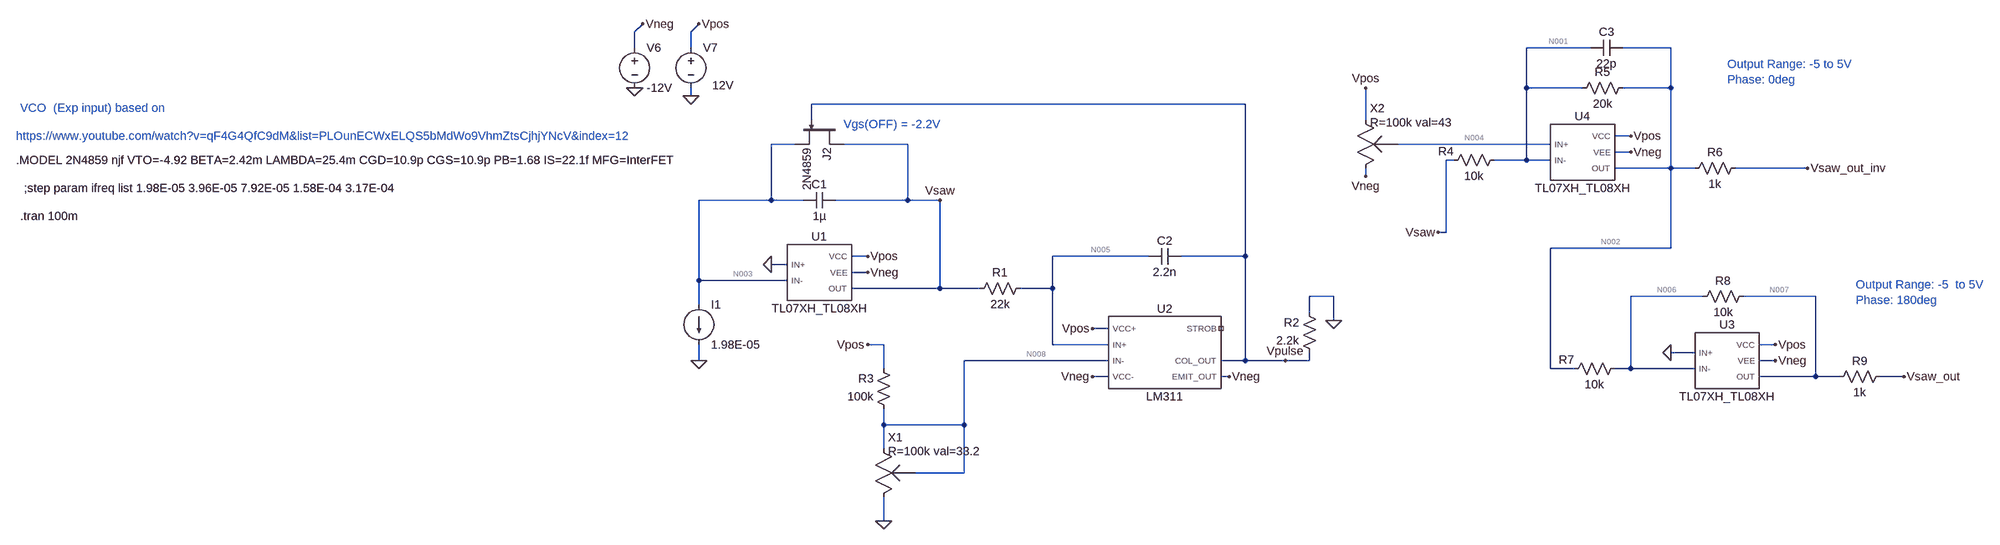
[diagram p0: schematic main_VCO_SAW.asc]
main_VCO_SAW.asc, the LTspice schematic file:
Version 4
SHEET 1 3072 1764
WIRE -1824 -624 -1808 -640
WIRE -1712 -624 -1696 -640
WIRE -1824 -592 -1824 -624
WIRE -1712 -592 -1712 -624
WIRE 80 -592 -48 -592
WIRE 240 -592 144 -592
WIRE -48 -512 -48 -592
WIRE 64 -512 -48 -512
WIRE 240 -512 240 -592
WIRE 240 -512 144 -512
WIRE -1712 -496 -1712 -512
WIRE -608 -480 -1472 -480
WIRE -1472 -448 -1472 -480
WIRE -368 -448 -368 -512
WIRE 160 -416 128 -416
WIRE -1504 -400 -1552 -400
WIRE -1280 -400 -1408 -400
WIRE 0 -400 -304 -400
WIRE 160 -384 128 -384
WIRE -192 -368 -208 -368
WIRE -48 -368 -48 -512
WIRE -48 -368 -112 -368
WIRE 0 -368 -48 -368
WIRE 240 -352 240 -512
WIRE 240 -352 128 -352
WIRE 288 -352 240 -352
WIRE 512 -352 368 -352
WIRE -368 -336 -368 -352
WIRE -1552 -288 -1552 -400
WIRE -1552 -288 -1696 -288
WIRE -1488 -288 -1552 -288
WIRE -1280 -288 -1280 -400
WIRE -1280 -288 -1424 -288
WIRE -1216 -288 -1280 -288
WIRE -208 -224 -208 -368
WIRE -208 -224 -224 -224
WIRE 240 -192 240 -352
WIRE 240 -192 0 -192
WIRE -1360 -176 -1392 -176
WIRE -800 -176 -992 -176
WIRE -608 -176 -608 -480
WIRE -608 -176 -736 -176
WIRE -1520 -160 -1552 -160
WIRE -1360 -144 -1392 -144
WIRE -1696 -128 -1696 -288
WIRE -1520 -128 -1696 -128
WIRE -1216 -112 -1216 -288
WIRE -1216 -112 -1392 -112
WIRE -1136 -112 -1216 -112
WIRE -992 -112 -992 -176
WIRE -992 -112 -1056 -112
WIRE -432 -96 -480 -96
WIRE 304 -96 160 -96
WIRE 528 -96 384 -96
WIRE -1696 -80 -1696 -128
WIRE -480 -64 -480 -96
WIRE -432 -48 -432 -96
WIRE -880 -32 -912 -32
WIRE -1328 0 -1360 0
WIRE -992 0 -992 -112
WIRE -880 0 -992 0
WIRE 448 0 416 0
WIRE 288 16 240 16
WIRE -1696 32 -1696 0
WIRE -880 32 -1168 32
WIRE -608 32 -608 -176
WIRE -608 32 -656 32
WIRE -528 32 -608 32
WIRE -480 32 -480 16
WIRE -480 32 -528 32
WIRE 448 32 416 32
WIRE -1328 48 -1328 0
WIRE 0 48 0 -192
WIRE 48 48 0 48
WIRE 160 48 160 -96
WIRE 160 48 128 48
WIRE 288 48 160 48
WIRE -880 64 -912 64
WIRE -640 64 -656 64
WIRE 528 64 528 -96
WIRE 528 64 416 64
WIRE 576 64 528 64
WIRE 704 64 656 64
WIRE -1328 160 -1328 128
WIRE -1168 160 -1168 32
WIRE -1168 160 -1328 160
WIRE -1328 208 -1328 160
WIRE -1168 256 -1168 160
WIRE -1168 256 -1264 256
WIRE -1328 352 -1328 304
FLAG -1824 -512 0
FLAG -1712 -496 0
FLAG -1808 -640 Vneg
FLAG -1696 -640 Vpos
FLAG -1696 32 0
FLAG -1552 -160 0
FLAG -1360 -144 Vneg
FLAG -1360 -176 Vpos
FLAG -912 -32 Vpos
FLAG -912 64 Vneg
FLAG -640 64 Vneg
FLAG -432 -48 0
FLAG -1216 -288 Vsaw
FLAG -528 32 Vpulse
FLAG -1328 352 0
FLAG 160 -384 Vneg
FLAG 160 -416 Vpos
FLAG 512 -352 Vsaw_out_inv
FLAG -224 -224 Vsaw
FLAG 448 32 Vneg
FLAG 448 0 Vpos
FLAG 704 64 Vsaw_out
FLAG 240 16 0
FLAG -368 -336 Vneg
FLAG -368 -512 Vpos
FLAG -1360 0 Vpos
SYMBOL voltage -1824 -608 R0
WINDOW 123 0 0 Left 0
WINDOW 39 0 0 Left 0
SYMATTR InstName V6
SYMATTR Value -12V
SYMBOL voltage -1712 -608 R0
WINDOW 123 0 0 Left 0
WINDOW 39 0 0 Left 0
WINDOW 3 43 91 Left 2
SYMATTR Value 12V
SYMATTR InstName V7
SYMBOL TL07XH_TL08XH -1456 -144 R0
SYMATTR InstName U1
SYMBOL current -1696 -80 R0
WINDOW 123 0 0 Left 0
WINDOW 39 0 0 Left 0
SYMATTR InstName I1
SYMATTR Value 1.98E-05
SYMBOL cap -1424 -304 R90
WINDOW 0 0 32 VBottom 2
WINDOW 3 32 32 VTop 2
SYMATTR InstName C1
SYMATTR Value 1µ
SYMBOL res -1040 -128 R90
WINDOW 0 0 56 VBottom 2
WINDOW 3 32 56 VTop 2
SYMATTR InstName R1
SYMATTR Value 22k
SYMBOL LM311 -768 16 R0
SYMATTR InstName U2
SYMBOL res -464 32 R180
WINDOW 0 36 76 Left 2
WINDOW 3 36 40 Left 2
SYMATTR InstName R2
SYMATTR Value 2.2k
SYMBOL cap -736 -192 R90
WINDOW 0 0 32 VBottom 2
WINDOW 3 32 32 VTop 2
SYMATTR InstName C2
SYMATTR Value 2.2n
SYMBOL res -1312 144 R180
WINDOW 0 36 76 Left 2
WINDOW 3 36 40 Left 2
SYMATTR InstName R3
SYMATTR Value 100k
SYMBOL pot -1344 192 R0
WINDOW 0 25 -7 Left 2
WINDOW 39 25 21 Left 2
SYMATTR InstName X1
SYMATTR SpiceLine R=100k val=33.2
SYMBOL njf -1408 -448 R90
SYMATTR InstName J2
SYMATTR Value 2N4859
SYMBOL TL07XH_TL08XH 64 -384 R0
SYMATTR InstName U4
SYMBOL res -96 -384 R90
WINDOW 0 14 112 VBottom 2
WINDOW 3 32 56 VTop 2
SYMATTR InstName R4
SYMATTR Value 10k
SYMBOL res 160 -528 R90
WINDOW 0 0 56 VBottom 2
WINDOW 3 32 56 VTop 2
SYMATTR InstName R5
SYMATTR Value 20k
SYMBOL cap 144 -608 R90
WINDOW 0 0 32 VBottom 2
WINDOW 3 32 32 VTop 2
SYMATTR InstName C3
SYMATTR Value 22p
SYMBOL res 384 -368 R90
WINDOW 0 0 56 VBottom 2
WINDOW 3 32 56 VTop 2
SYMATTR InstName R6
SYMATTR Value 1k
SYMBOL TL07XH_TL08XH 352 32 R0
SYMATTR InstName U3
SYMBOL res 144 32 R90
WINDOW 0 14 112 VBottom 2
WINDOW 3 32 56 VTop 2
SYMATTR InstName R7
SYMATTR Value 10k
SYMBOL res 400 -112 R90
WINDOW 0 0 56 VBottom 2
WINDOW 3 32 56 VTop 2
SYMATTR InstName R8
SYMATTR Value 10k
SYMBOL res 672 48 R90
WINDOW 0 0 56 VBottom 2
WINDOW 3 32 56 VTop 2
SYMATTR InstName R9
SYMATTR Value 1k
SYMBOL pot -384 -464 R0
WINDOW 0 25 -7 Left 2
WINDOW 39 25 21 Left 2
SYMATTR InstName X2
SYMATTR SpiceLine R=100k val=43
TEXT -3056 -416 Left 2 ;https://www.youtube.com/watch?v=qF4G4QfC9dM&list=PLOunECWxELQS5bMdWo9VhmZtsCjhjYNcV&index=12
TEXT -3048 -472 Left 2 ;VCO  (Exp input) based on
TEXT -3040 -312 Left 2 !;step param ifreq list 1.98E-05 3.96E-05 7.92E-05 1.58E-04 3.17E-04
TEXT -3048 -256 Left 2 !.tran 100m
TEXT -1408 -440 Left 2 ;Vgs(OFF) = -2.2V
TEXT -3056 -368 Left 2 !.MODEL 2N4859 njf VTO=-4.92 BETA=2.42m LAMBDA=25.4m CGD=10.9p CGS=10.9p PB=1.68 IS=22.1f MFG=InterFET
TEXT 352 -560 Left 2 ;Output Range: -5 to 5V\nPhase: 0deg
TEXT 608 -120 Left 2 ;Output Range: -5  to 5V\nPhase: 180deg

The netlist it stands for:
* main_VCO_SAW.asc
V6 Vneg 0 -12V
V7 Vpos 0 12V
XU1 0 N003 Vpos Vneg Vsaw TL07XH_TL08XH  ; pins IN+ IN- VCC VEE OUT
I1 N003 0 1.98E-05
C1 Vsaw N003 1µ
R1 N005 Vsaw 22k
XU2 N005 N008 Vpos Vneg NC_01 Vpulse Vneg LM311  ; pins IN+ IN- VCC+ VCC- STROB COL_OUT EMIT_OUT
R2 Vpulse 0 2.2k
C2 Vpulse N005 2.2n
R3 N008 Vpos 100k
XX1 N008 0 N008 pot R=100k val=33.2  ; pins 1 3 2
J2 Vsaw Vpulse N003 2N4859
XU4 N004 N001 Vpos Vneg N002 TL07XH_TL08XH  ; pins IN+ IN- VCC VEE OUT
R4 N001 Vsaw 10k
R5 N002 N001 20k
C3 N002 N001 22p
R6 Vsaw_out_inv N002 1k
XU3 0 N006 Vpos Vneg N007 TL07XH_TL08XH  ; pins IN+ IN- VCC VEE OUT
R7 N006 N002 10k
R8 N007 N006 10k
R9 Vsaw_out N007 1k
XX2 Vpos Vneg N004 pot R=100k val=43  ; pins 1 3 2
.model NJF NJF
.model PJF PJF
.lib standard.jft
* https://www.youtube.com/watch?v=qF4G4QfC9dM&list=PLOunECWxELQS5bMdWo9VhmZtsCjhjYNcV&index=12
* VCO  (Exp input) based on
;step param ifreq list 1.98E-05 3.96E-05 7.92E-05 1.58E-04 3.17E-04
.tran 100m
* Vgs(OFF) = -2.2V
.MODEL 2N4859 njf VTO=-4.92 BETA=2.42m LAMBDA=25.4m CGD=10.9p CGS=10.9p PB=1.68 IS=22.1f MFG=InterFET
* Output Range: -5 to 5V
* Phase: 0deg
* Output Range: -5  to 5V
* Phase: 180deg
.lib C:\HOME_projects\SYNTH_GOOM\2LineartoExponential\tl07xh_tl08xh.lib
.lib C:\HOME_projects\SYNTH_GOOM\2LineartoExponential\lm311.lib
.backanno
.end

* Results of the author's LTspice run, read from the files saved beside the schematic
* Operating Point, zero values left out:
*   V(vneg) = -12 V
*   V(vpos) = 12 V
*   V(vsaw) = -3.597 mV
*   V(n003) = -4.428 mV
*   V(n005) = -5.797 mV
*   V(vpulse) = -52.83 nV
*   V(n008) = 4.802 V
*   V(n002) = 5.034 V
*   V(n001) = 1.676 V
*   V(n004) = 1.68 V
*   V(vsaw_out_inv) = 5.034 V
*   V(n007) = -5.043 V
*   V(n006) = -4.427 mV
*   V(vsaw_out) = -5.043 V
*   I(I1) = 19.8 µA
*   Id(J2) = 19.8 µA
*   Is(J2) = -19.8 µA
*   I(R8) = -503.8 µA
*   I(R7) = -503.8 µA
*   I(R5) = 167.9 µA
*   I(R4) = 167.9 µA
*   I(R3) = -71.98 µA
*   I(R2) = -24.02 pA
*   I(R1) = -100 nA
*   I(V7) = -8.896 mA
*   I(V6) = 8.805 mA
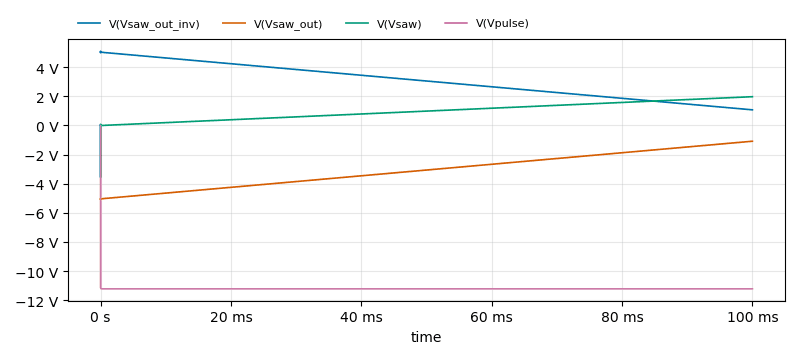
[diagram p1: Transient Analysis of main_VCO_SAW.asc, plotted from the saved traces]
* Transient Analysis, 1 run:
*   V(Vsaw_out_inv): min 1.074 V, max 5.1 V, average 3.054 V, rms 3.261 V, last 1.074 V
*   V(Vsaw_out): min -5.118 V, max -1.083 V, average -3.063 V, rms 3.269 V, last -1.083 V
*   V(Vsaw): min -3.569 V, max 1.976 V, average 986.5 mV, rms 1.14 V, last 1.976 V
*   V(Vpulse): min -11.22 V, max 0 V, average -11.22 V, rms 11.22 V, last -11.22 V